# EAGLE design JN5168_Programmer (EAGLE 7.3.0)
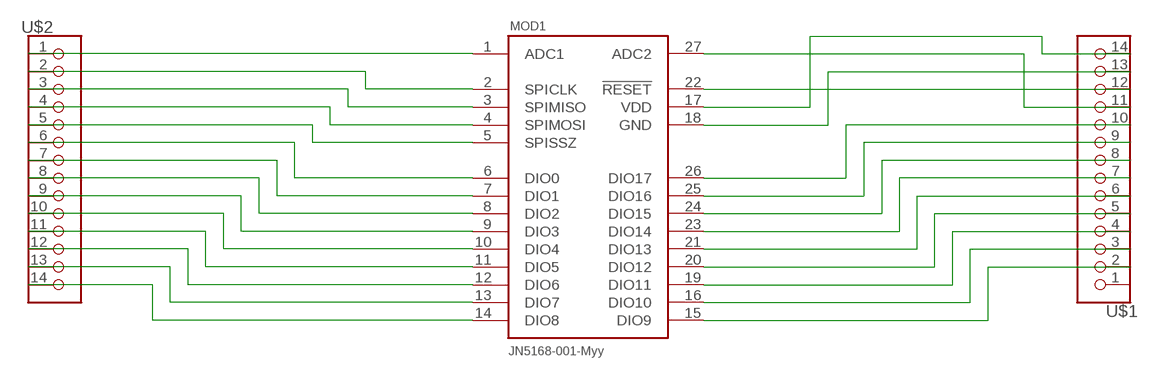
[diagram p0: schematic, sheet 1]

## Parts
MOD1  JN5168-001-M00  [JN5168-001-M00]
U$1  HEADER_1X14_100MIL_PTH  [HEADER_100MIL_1X14_PTH]
U$2  HEADER_1X14_100MIL_PTH  [HEADER_100MIL_1X14_PTH]

## Nets
GND: MOD1.18(GND) U$1.13
N$1: MOD1.1(ADC1) U$2.1
N$2: MOD1.2(SPICLK) U$2.2
N$3: MOD1.3(SPIMISO) U$2.3
N$4: MOD1.4(SPIMOSI) U$2.4
N$5: MOD1.5(SPISSZ) U$2.5
N$6: MOD1.6(DIO0) U$2.6
N$7: MOD1.7(DIO1) U$2.7
N$8: MOD1.8(DIO2) U$2.8
N$9: MOD1.9(DIO3) U$2.9
N$10: MOD1.10(DIO4) U$2.10
N$11: MOD1.11(DIO5) U$2.11
N$12: MOD1.12(DIO6) U$2.12
N$13: MOD1.13(DIO7) U$2.13
N$14: MOD1.14(DIO8) U$2.14
N$15: MOD1.27(ADC2) U$1.11
N$16: MOD1.22(!RESET) U$1.12
N$17: MOD1.17(VDD) U$1.14
N$19: MOD1.26(DIO17) U$1.10
N$20: MOD1.25(DIO16) U$1.9
N$21: MOD1.24(DIO15) U$1.8
N$22: MOD1.23(DIO14) U$1.7
N$23: MOD1.21(DIO13) U$1.6
N$24: MOD1.20(DIO12) U$1.5
N$25: MOD1.19(DIO11) U$1.4
N$26: MOD1.16(DIO10) U$1.3
N$27: MOD1.15(DIO9) U$1.2
Unconnected: U$1.1

## Library data of the parts
MOD1 = heck:JN5168-001-M: The JN5168-001-Myy family is a range of ultra low power, high performance surface mount modules targeted at IEEE 802.15.4, JenNet-IP, ZigBee Light Link, ZigBee Smart Energy and RF4CE networking applications, enabling users to realise products with minimum time to market and at the lowest cost. They remove the need for expensive and lengthy development of custom RF board designs and test suites. The modules use NXP’s JN5168 wireless microcontroller to provide a comprehensive solution with large memory, high CPU and radio performance and all RF components included. All that is required to develop and manufacture wireless control or sensing products is to connect a power supply and peripherals such as switches, actuators and sensors, considerably simplifying product development. Four module variants are available: JN5168-001-M00 with an integrated antenna, JN5168-001-M03 with an antenna connector and the JN5168-001-M05 and M06 with an antenna connector, power amplifier and LNA for extended range. The JN5168-001-M05 output power has been optimised for use in Europe and Asia.
U$1 U$2 = heck:HEADER_1X14

## Board
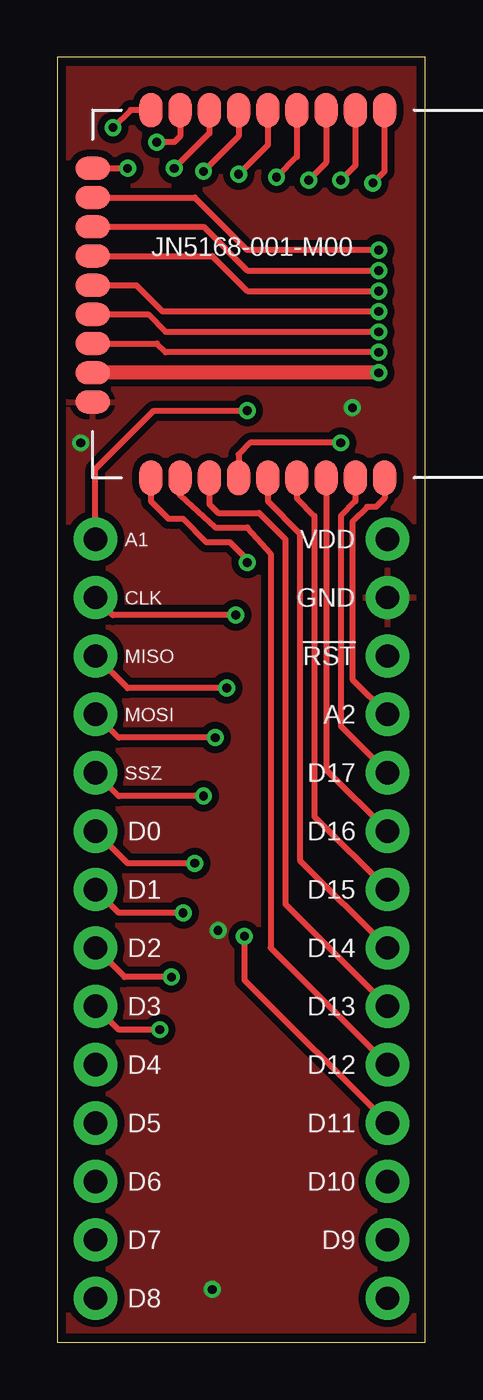
[diagram p1: board, top side]
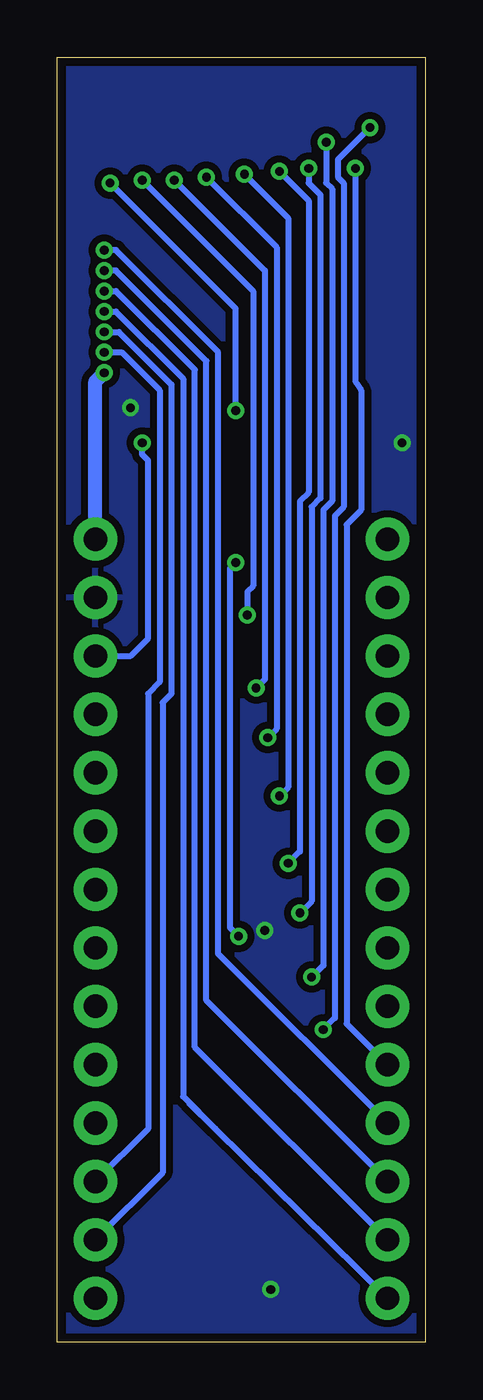
[diagram p2: board, bottom side, seen from below]

Size 16 x 55.88 mm. Coordinates in mm from the lower left corner, seen from the top.
Outline: 0,0 16,0 16,55.88 0,55.88 0,0
Copper layers (1*16): Top 0.0356mm / dielectric 1.5011mm / Bottom 0.0356mm
Design rules "heck": minimum track width 6mil, minimum drill 13mil, track to track 6mil, track to pad 6mil, pad to pad 6mil, via to via 6mil, smd to smd 6mil, copper to edge 15mil, drill to drill 6mil, minimum pad ring 7mil, minimum via ring 7mil, stop-mask expansion 3mil, vias tented up to drill 20mil, thermal gap 10mil

### Footprints (pad centres in the part's own frame; a part is rotated, then mirrored left to right if it is on the bottom)
JN5168-001-M00 = smd 1.5 x 1: 1 -7.62,10.16; 2 -7.62,8.89; 3 -7.62,7.62; 4 -7.62,6.35; 5 -7.62,5.08; 6 -7.62,3.81; 7 -7.62,2.54; 8 -7.62,1.27; 9 -7.62,0; 19 8.38,0; 20 8.38,1.27; 21 8.38,2.54; 22 8.38,3.81; 23 8.38,5.08; 24 8.38,6.35; 25 8.38,7.62; 26 8.38,8.89; 27 8.38,10.16 | smd 1 x 1.5: 10 -5.08,-2.54; 11 -3.81,-2.54; 12 -2.54,-2.54; 13 -1.27,-2.54; 14 0,-2.54; 15 1.27,-2.54; 16 2.54,-2.54; 17 3.81,-2.54; 18 5.08,-2.54
HEADER_100MIL_1X14_PTH = drill 1.016 pad 1.88: 1 -16.51,0; 2 -13.97,0; 3 -11.43,0; 4 -8.89,0; 5 -6.35,0; 6 -3.81,0; 7 -1.27,0; 8 1.27,0; 9 3.81,0; 10 6.35,0; 11 8.89,0; 12 11.43,0; 13 13.97,0; 14 16.51,0

### Placement (x,y rotation side)
MOD1  4.06,45.97 270 top
U$1  14.35,18.41 90 top
U$2  1.65,18.41 270 top

### Tracks (layer width: path | path; a pad name or v marks a point on that pad's centre or on a via)
GND  (via drill 0.38)
  other vias: 1.02,39.12 12.83,40.64 6.73,2.29 6.99,17.91
  pour Bottom (isolate 0.305, rank 5): 0,0 16,0 16,55.88 0,55.88
  pour Top (isolate 0.305, rank 5): 0,55.88 0,0 16,0 16,55.88
N$1  (via drill 0.38)
  Top 0.254: U$2.1 1.65,37.97 4.19,40.51 v8.26,40.51 | v13.72,50.42 14.22,50.93 MOD1.1
  Bottom 0.254: v8.26,40.51 8.26,44.96 v13.72,50.42
N$2  (via drill 0.38)
  Top 0.254: MOD1.2 12.95,51.18 v12.32,50.55 | v7.75,31.62 2.41,31.62 U$2.2
  Bottom 0.254: v12.32,50.55 7.49,45.72 7.49,32.89 7.75,32.64 v7.75,31.62
N$3  (via drill 0.38)
  Top 0.254: MOD1.3 11.68,51.31 v10.92,50.55 | v7.37,28.45 3.05,28.45 U$2.3
  Bottom 0.254: v10.92,50.55 6.99,46.61 6.99,28.83 v7.37,28.45
N$4  (via drill 0.38)
  Top 0.254: MOD1.4 10.41,51.56 v9.53,50.67 | v6.86,26.29 2.67,26.29 U$2.4
  Bottom 0.254: v9.53,50.67 6.48,47.62 6.48,26.67 v6.86,26.29
N$5  (via drill 0.38)
  Top 0.254: MOD1.5 9.14,52.07 v7.87,50.8 | v6.35,23.75 2.67,23.75 U$2.5
  Bottom 0.254: v7.87,50.8 5.97,48.9 5.97,24.13 v6.35,23.75
N$6  (via drill 0.38)
  Top 0.254: MOD1.6 7.87,52.45 v6.35,50.93 | v5.97,20.83 3.05,20.83 U$2.6
  Bottom 0.254: v6.35,50.93 5.08,49.66 5.08,36.96 5.46,36.58 5.46,21.34 v5.97,20.83
N$7  (via drill 0.38)
  Top 0.254: MOD1.7 6.6,52.58 v5.08,51.05 | v5.46,18.67 2.67,18.67 U$2.7
  Bottom 0.254: v5.08,51.05 5.08,50.42 4.57,49.91 4.57,36.7 4.95,36.32 4.95,19.18 v5.46,18.67
N$8  (via drill 0.38)
  Top 0.254: MOD1.8 5.33,52.45 5.08,52.2 v4.32,52.2 | v4.95,15.88 2.92,15.88 U$2.8
  Bottom 0.254: v4.32,52.2 4.32,50.42 4.06,50.16 4.06,36.58 4.45,36.2 4.45,16.38 v4.95,15.88
N$9  (via drill 0.38)
  Top 0.254: MOD1.9 3.17,53.59 v2.41,52.83 | v4.45,13.59 2.67,13.59 U$2.9
  Bottom 0.254: v2.41,52.83 3.81,51.44 3.81,50.67 3.56,50.42 3.56,36.32 3.94,35.94 3.94,14.1 v4.45,13.59
N$10  (via drill 0.38)
  Top 0.254: MOD1.10 v3.05,51.05
  Bottom 0.254: v3.05,51.05 3.05,41.78 2.79,41.4 2.79,36.2 3.43,35.56 3.43,13.84 U$2.10
N$11  (via drill 0.38)
  Top 0.254: MOD1.11 5.97,49.78 8.26,47.5 v13.97,47.5
  Bottom 0.254: U$2.11 9.02,16.89 9.02,43.05 13.46,47.5 v13.97,47.5
N$12  (via drill 0.38)
  Top 0.254: MOD1.12 6.35,48.51 8.26,46.61 v13.97,46.61
  Bottom 0.254: U$2.12 9.53,14.86 9.53,42.67 13.46,46.61 v13.97,46.61
N$13  (via drill 0.38)
  Top 0.254: MOD1.13 6.73,47.24 8.26,45.72 v13.97,45.72
  Bottom 0.254: U$2.13 10.03,12.83 10.03,42.29 13.46,45.72 v13.97,45.72
N$14  (via drill 0.38)
  Top 0.254: MOD1.14 3.43,45.97 4.57,44.83 v13.97,44.83
  Bottom 0.254: 10.29,10.41 9.14,9.28 | 9.14,9.28 U$2.14 | v13.97,44.83 13.46,44.83 10.54,41.91 10.54,10.69 9.14,9.28
N$15
  Top 0.254: MOD1.27 14.22,36.7 13.84,36.32 13.46,36.32 12.83,35.69 12.83,28.83 U$1.11
N$16  (via drill 0.38)
  Top 0.254: v12.32,39.12 8.38,39.12 7.87,38.61 MOD1.22
  Bottom 0.254: U$1.12 12.83,29.84 12.06,30.61 12.06,38.35 12.32,38.61 v12.32,39.12
N$17  (via drill 0.38)
  Top 0.61: v13.97,42.16 MOD1.17
  Bottom 0.61: U$1.14 14.35,41.78 v13.97,42.16
N$19
  Top 0.254: MOD1.26 12.95,36.58 12.32,35.94 12.32,26.8 U$1.10
N$20
  Top 0.254: MOD1.25 11.68,24.89 U$1.9
N$21
  Top 0.254: MOD1.24 10.41,36.7 11.18,35.94 11.18,22.86 U$1.8
N$22
  Top 0.254: MOD1.23 9.14,36.58 10.54,35.18 10.54,20.95 U$1.7
N$23
  Top 0.254: MOD1.21 6.6,36.45 6.99,36.07 8.76,36.07 9.91,34.92 9.91,19.05 U$1.6
N$24
  Top 0.254: MOD1.20 5.33,36.83 6.86,35.43 8.26,35.43 9.27,34.29 9.27,17.14 U$1.5
N$25  (via drill 0.38)
  Top 0.254: MOD1.19 4.06,36.58 4.83,35.81 5.46,35.81 6.48,34.8 7.49,34.8 8.26,34.04 v8.26,33.91 | U$1.4 8.13,15.75 v8.13,17.65
  Bottom 0.254: v8.26,33.91 8.51,33.66 8.51,18.03 v8.13,17.65
N$26  (via drill 0.38)
  Top 0.254: MOD1.16 4.32,43.43 4.7,43.05 v13.97,43.05
  Bottom 0.254: U$1.3 12.06,9.27 12.06,28.19 11.56,28.7 11.56,41.4 13.21,43.05 v13.97,43.05
N$27  (via drill 0.38)
  Top 0.254: MOD1.15 3.94,44.7 4.7,43.94 v13.97,43.94
  Bottom 0.254: U$1.2 11.43,7.37 11.43,27.81 11.05,28.19 11.05,41.66 13.34,43.94 v13.97,43.94

### Text on the board
tPlace: A1 | VDD | CLK | GND | MISO | !RST | MOSI | A2 | SSZ | D17 | D0 | D16 | D1 | D15 | D2 | D14 | D3 | D13 | D4 | D12 | D5 | D11 | D6 | D10 | D7 | D9 | D8